# Altium schematic sheet main.SchDoc
size 420 x 297 mm; SheetNumber: 1; SheetTotal: 1
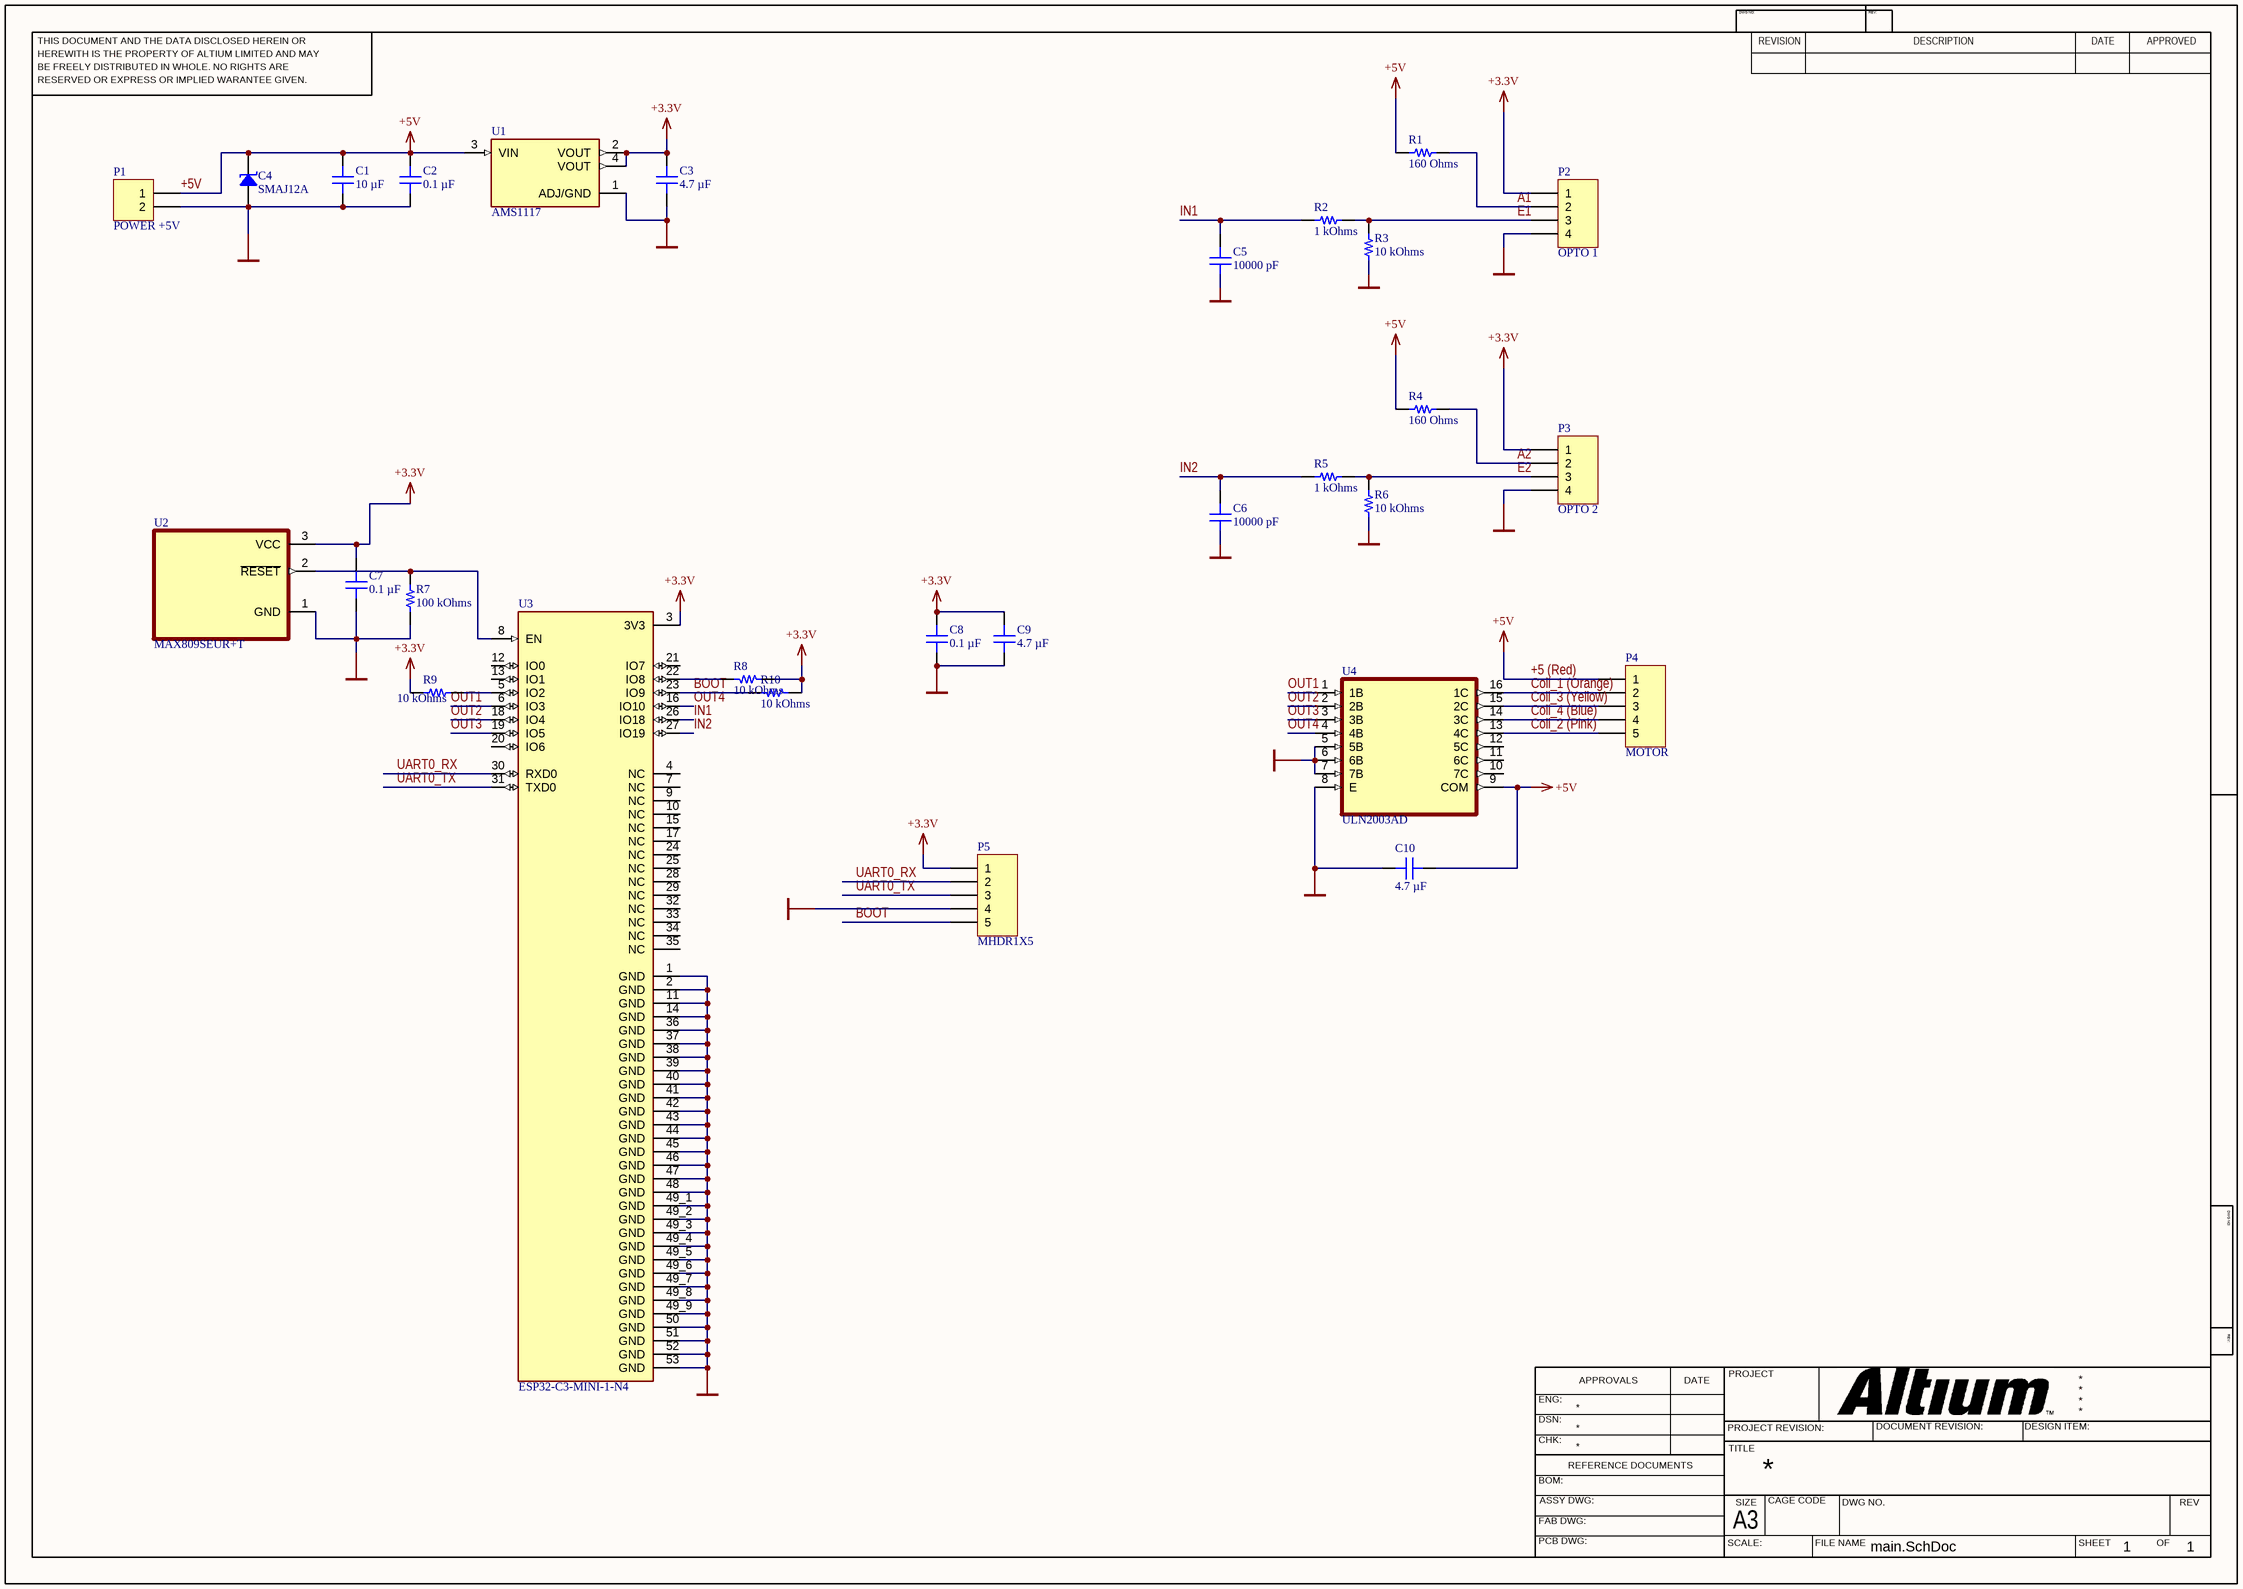
[diagram p0: main.SchDoc]

## Parts
C1  10 µF  [CAP 0805_2012]
C2  0.1 µF  [CAP 0603_1608]
C3  Capacitance: 4.7 µF  [CAP 0603_1608]
C4  SMAJ12A  [DO214AC SMA]
C5  10000 pF  [CAP 0603_1608]
C6  10000 pF  [CAP 0603_1608]
C7  0.1 µF  [CAP 0603_1608]
C8  0.1 µF  [CAP 0603_1608]
C9  4.7 µF  [CAP 0603_1608]
C10  Capacitance: 4.7 µF  [CAP 0603_1608]
P1  POWER +5V  [HDR1X2H]
P2  OPTO 1  [HDR1X4H]
P3  OPTO 2  [HDR1X4H]
P4  MOTOR  [HDR1X5H]
P5  MHDR1X5  [MHDR1X5]
R1  160 Ohms  [YAGEO RES 0805_2012]
R2  1 kOhms  [YAGEO RES 0603_1608]
R3  10 kOhms  [YAGEO RES 0603_1608]
R4  160 Ohms  [YAGEO RES 0805_2012]
R5  1 kOhms  [YAGEO RES 0603_1608]
R6  10 kOhms  [YAGEO RES 0603_1608]
R7  100 kOhms  [YAGEO RES 0603_1608]
R8  10 kOhms  [YAGEO RES 0603_1608]
R9  10 kOhms  [YAGEO RES 0603_1608]
R10  10 kOhms  [YAGEO RES 0603_1608]
U1  AMS1117  [SOT229P700X180-4N]
U2  MAX809SEUR+T  [SOT95P237X112-3N]
U3  ESP32-C3-MINI-1-N4  [XCVR_ESP32-C3-MINI-1-N4]
U4  ULN2003AD  [SOIC127P600X175-16N]

## Nets
+3.3V: C3.2 C7.2 C8.2 C9.2 P2.1 P3.1 P5.1 R8.2 R9.2 R10.2 U1.2(VOUT) U1.4(VOUT) U2.3(VCC) U3.3(3V3)
+5 (Red): C1.2 C2.2 C4.2 C10.1 P1.1 P4.1 R1.2 R4.2 U1.3(VIN) U4.9(COM)  [also labelled +5V]
GND: C1.1 C2.1 C3.1 C4.1 C5.1 C6.1 C7.1 C8.1 C9.1 C10.2 P1.2 P2.4 P3.4 P5.4 R3.1 R6.1 R7.1 U1.1(ADJ/GND) U2.1(GND) U3.1(GND) U3.2(GND) U3.11(GND) U3.14(GND) U3.36(GND) U3.37(GND) U3.38(GND) U3.39(GND) U3.40(GND) U3.41(GND) U3.42(GND) U3.43(GND) U3.44(GND) U3.45(GND) U3.46(GND) U3.47(GND) U3.48(GND) U3.49_1(GND) U3.49_2(GND) U3.49_3(GND) U3.49_4(GND) U3.49_5(GND) U3.49_6(GND) U3.49_7(GND) U3.49_8(GND) U3.49_9(GND) U3.50(GND) U3.51(GND) U3.52(GND) U3.53(GND) U4.5(5B) U4.6(6B) U4.7(7B) U4.8(E)
A1: P2.2 R1.1
A2: P3.2 R4.1
BOOT: P5.5 R10.1 U3.23(IO9)
Coil_1 (Orange): P4.2 U4.16(1C)
Coil_2 (Pink): P4.5 U4.13(4C)
Coil_3 (Yellow): P4.3 U4.15(2C)
Coil_4 (Blue): P4.4 U4.14(3C)
E1: P2.3 R2.1 R3.2
E2: P3.3 R5.1 R6.2
IN1: C5.2 R2.2 U3.26(IO18)
IN2: C6.2 R5.2 U3.27(IO19)
OUT1: U3.6(IO3) U4.1(1B)
OUT2: U3.18(IO4) U4.2(2B)
OUT3: U3.19(IO5) U4.3(3B)
OUT4: U3.16(IO10) U4.4(4B)
UART0_RX: P5.2 U3.30(RXD0)
UART0_TX: P5.3 U3.31(TXD0)
NetR7_2: R7.2 U2.2(~{RESET}) U3.8(EN)
NetR8_1: R8.1 U3.22(IO8)
NetR9_1: R9.1 U3.5(IO2)

Not connected (* = marked no-connect by the designer): U3 4(NC) 7(NC) 9(NC) 10(NC) 12(IO0) 13(IO1) 15(NC) 17(NC) 20(IO6) 21(IO7) 24(NC) 25(NC) 28(NC) 29(NC) 32(NC) 33(NC) 34(NC) 35(NC); U4 10(7C) 11(6C) 12(5C)

## Notes on the sheet
- THIS DOCUMENT AND THE DATA DISCLOSED HEREIN OR
- HEREWITH IS THE PROPERTY OF ALTIUM LIMITED AND MAY
- DWG NO:
- REVISION
- REV:
- DESCRIPTION
- DATE
- APPROVED
- BE FREELY DISTRIBUTED IN WHOLE. NO RIGHTS ARE
- RESERVED OR EXPRESS OR IMPLIED WARANTEE GIVEN.
- ENG:
- APPROVALS
- PROJECT
- DSN:
- CHK:
- REFERENCE DOCUMENTS
- PROJECT REVISION:
- TITLE
- DOCUMENT REVISION:
- DESIGN ITEM:
- BOM:
- FAB DWG:
- PCB DWG:
- ASSY DWG:
- SCALE:
- A3
- SIZE
- CAGE CODE
- FILE NAME
- DWG NO.
- SHEET
- OF
- REV

## Library data of the parts
C1 = CC0805KKX5R8BB106: CAP CER 10UF 25V X5R 0805; manufacturer: Yageo; Tolerance: ±10%; Part Number: CC0805KKX5R8BB106; Capacitance: 10 µF; Applications: General Purpose; componentlink1description: Datasheet; componentlink1url: https://www.yageo.com/upload/media/product/productsearch/datasheet/mlcc/UPY-GPHC_X5R_4V-to-50V_25.pdf; componentlink2description: DigiKey Link; componentlink2url: https://www.digikey.com/en/products/detail/yageo/CC0805KKX5R8BB106/5195275; Device Package: 0805 (2012 Metric); lastupdated: 09.02.2024 20:15:28; Lifecycle Status: Active; Minimum Order: 1; Mounting Type: Surface Mount, MLCC; Operating Temperature: -55°C ~ 85°C; Package / Case: 0805 (2012 Metric); packaging: TapeAndReel; partid: 16151; Part Status: Active; price: 0.06; series: CC; Size / Dimension: 0.079" L x 0.049" W (2.00mm x 1.25mm); Supplier 1: DigiKey; Supplier Part Number 1: 311-1869-1-ND; Temperature Coefficient: X5R; Thickness (Max): 0.057" (1.45mm); value: 10 µF; Voltage - Rated: 25V
C2 C7 C8 = CC0603KRX7R9BB104: CAP CER 0.1UF 50V X7R 0603; manufacturer: Yageo; Tolerance: ±10%; Part Number: CC0603KRX7R9BB104; Capacitance: 0.1 µF; Applications: General Purpose; componentlink1description: Datasheet; componentlink1url: https://www.yageo.com/upload/media/product/productsearch/datasheet/mlcc/UPY-GPHC_X7R_6.3V-to-50V_18.pdf; componentlink2description: DigiKey Link; componentlink2url: https://www.digikey.com/en/products/detail/yageo/CC0603KRX7R9BB104/2103082; Device Package: 0603 (1608 Metric); lastupdated: 09.02.2024 20:10:21; Lifecycle Status: Active; Minimum Order: 1; Mounting Type: Surface Mount, MLCC; Operating Temperature: -55°C ~ 125°C; Package / Case: 0603 (1608 Metric); packaging: TapeAndReel; partid: 9506; Part Status: Active; price: 0.01; series: CC; Size / Dimension: 0.063" L x 0.031" W (1.60mm x 0.80mm); Supplier 1: DigiKey; Supplier Part Number 1: 311-1344-1-ND; Temperature Coefficient: X7R; Thickness (Max): 0.035" (0.90mm); value: 0.1 µF; Voltage - Rated: 50V
C3 C10 = C0603C475K9PAC7867: CAP CER 4.7UF 6.3V X5R 0603; Part Number: C0603C475K9PAC7867
C4 = SMAJ12A: TVS DIODE 12VWM 19.9VC DO214AC; Manufacturer: Littelfuse Inc.; Current - Peak Pulse (10/1000µs): 20.1A; Power Line Protection: No; Power - Peak Pulse: 400W; Type: Zener; Unidirectional Channels: 1; Voltage - Breakdown (Min): 13.3V; Voltage - Clamping (Max) @ Ipp: 19.9V; Voltage - Reverse Standoff (Typ): 12V; Part Number: SMAJ12A; Applications: General Purpose; ComponentLink1Description: Datasheet; ComponentLink1URL: https://www.littelfuse.com/~/media/electronics/datasheets/tvs_diodes/littelfuse_tvs_diode_smaj_datasheet.pdf.pdf; ComponentLink2Description: DigiKey Link; ComponentLink2URL: https://www.digikey.com/en/products/detail/littelfuse-inc/SMAJ12A/762270; LastUpdated: 03.06.2024 19:57:22; Lifecycle Status: Active; Minimum Order: 1; Mounting Type: Surface Mount; Operating Temperature: -65°C ~ 150°C (TJ); Package / Case: DO-214AC, SMA; Packaging: TapeAndReel; PartId: 5712; Part Status: Active; Price: 0.08; Series: SMAJ; Supplier 1: DigiKey; Supplier Part Number 1: SMAJ12ALFCT-ND; Supplier Device Package: DO-214AC (SMA)
C5 C6 = CC0603KRX7R9BB103: CAP CER 10000PF 50V X7R 0603; manufacturer: Yageo; Tolerance: ±10%; Part Number: CC0603KRX7R9BB103; Capacitance: 10000 pF; Applications: General Purpose; componentlink1description: Datasheet; componentlink1url: https://www.yageo.com/upload/media/product/productsearch/datasheet/mlcc/UPY-GPHC_X7R_6.3V-to-50V_18.pdf; componentlink2description: DigiKey Link; componentlink2url: https://www.digikey.com/en/products/detail/yageo/CC0603KRX7R9BB103/302819; Device Package: 0603 (1608 Metric); lastupdated: 09.02.2024 20:10:06; Lifecycle Status: Active; Minimum Order: 1; Mounting Type: Surface Mount, MLCC; Operating Temperature: -55°C ~ 125°C; Package / Case: 0603 (1608 Metric); packaging: TapeAndReel; partid: 17848; Part Status: Active; price: 0.01; series: CC; Size / Dimension: 0.063" L x 0.031" W (1.60mm x 0.80mm); Supplier 1: DigiKey; Supplier Part Number 1: 311-1085-1-ND; Temperature Coefficient: X7R; Thickness (Max): 0.035" (0.90mm); value: 10000 pF; Voltage - Rated: 50V
C9 = C0603C475K9PAC7867: CAP CER 4.7UF 6.3V X5R 0603; manufacturer: KEMET; Tolerance: ±10%; Part Number: C0603C475K9PAC7867; Capacitance: 4.7 µF; Applications: Bypass, Decoupling; componentlink1description: Datasheet; componentlink1url: https://api.kemet.com/component-edge/download/datasheet/C0603C475K9PACTU.pdf; componentlink2description: DigiKey Link; componentlink2url: https://www.digikey.com/en/products/detail/kemet/C0603C475K9PAC7867/754744; Device Package: 0603 (1608 Metric); lastupdated: 09.02.2024 20:09:55; Lifecycle Status: Active; Minimum Order: 1; Mounting Type: Surface Mount, MLCC; Operating Temperature: -55°C ~ 85°C; Package / Case: 0603 (1608 Metric); packaging: TapeAndReel; partid: 34879; Part Status: Active; price: 0.02; series: SMD Comm X5R; Size / Dimension: 0.063" L x 0.031" W (1.60mm x 0.80mm); Supplier 1: DigiKey; Supplier Part Number 1: 399-C0603C475K9PAC7867CT-ND; Temperature Coefficient: X5R; Thickness (Max): 0.035" (0.90mm); value: 4.7 µF; Voltage - Rated: 6.3V
P1 = Header 2H: Header, 2-Pin, Right Angle; LatestRevisionDate: 17-Jul-2002; LatestRevisionNote: Re-released for DXP Platform.; Publisher: Altium Limited
P2 P3 = Header 4H: Header, 4-Pin, Right Angle; LatestRevisionDate: 17-Jul-2002; LatestRevisionNote: Re-released for DXP Platform.; Publisher: Altium Limited
P4 = Header 5H: Header, 5-Pin, Right Angle; LatestRevisionDate: 17-Jul-2002; LatestRevisionNote: Re-released for DXP Platform.; Publisher: Altium Limited
P5 = MHDR1X5: Header, 5-Pin; LatestRevisionDate: 17-Jul-2002; LatestRevisionNote: Re-released for DXP Platform.; Publisher: Altium Limited
R1 R4 = RC0805JR-07160RL: RES 160 OHM 5% 1/8W 0805; Manufacturer: Yageo; Power (Watts): 0.125W, 1/8W; Temperature Coefficient: ±100ppm/°C; Part Number: RC0805JR-07160RL; Value: 160 Ohms; ComponentLink1Description: Datasheet; ComponentLink1URL: https://www.yageo.com/upload/media/product/productsearch/datasheet/rchip/PYu-RC_Group_51_RoHS_L_10.pdf; ComponentLink2Description: DigiKey Link; ComponentLink2URL: https://www.digikey.com/en/products/detail/yageo/RC0805JR-07160RL/728259; Composition: Thick Film; Device Package: 0805 (2012 Metric); Features: Moisture Resistant; Height - Seated (Max): 0.024" (0.60mm); LastUpdated: 25.07.2024 9:20:20; Lifecycle Status: Active; Minimum Order: 1; Number of Terminations: 2; Operating Temperature: -55°C ~ 155°C; Package / Case: 0805 (2012 Metric); Packaging: CutTape; PartId: 41917; Part Status: Active; Price: 0.01; Resistance: 160 Ohms; Series: RC_L; Size / Dimension: 0.079" L x 0.049" W (2.00mm x 1.25mm); Supplier 1: DigiKey; Supplier Part Number 1: 311-160ARCT-ND; Supplier Device Package: 0805; Tolerance: ±5%
R2 R5 = RC0603JR-071KL: RES 1K OHM 5% 1/10W 0603; Manufacturer: Yageo; Power (Watts): 0.1W, 1/10W; Temperature Coefficient: ±100ppm/°C; Part Number: RC0603JR-071KL; Value: 1 kOhms; ComponentLink1Description: Datasheet; ComponentLink1URL: https://www.yageo.com/upload/media/product/productsearch/datasheet/rchip/PYu-RC_Group_51_RoHS_L_10.pdf; ComponentLink2Description: DigiKey Link; ComponentLink2URL: https://www.digikey.com/en/products/detail/yageo/RC0603JR-071KL/726677; Composition: Thick Film; Device Package: 0603 (1608 Metric); Features: Moisture Resistant; Height - Seated (Max): 0.022" (0.55mm); LastUpdated: 25.07.2024 9:19:19; Lifecycle Status: Active; Minimum Order: 1; Number of Terminations: 2; Operating Temperature: -55°C ~ 155°C; Package / Case: 0603 (1608 Metric); Packaging: CutTape; PartId: 22594; Part Status: Active; Price: 0.01; Resistance: 1 kOhms; Series: RC_L; Size / Dimension: 0.063" L x 0.031" W (1.60mm x 0.80mm); Supplier 1: DigiKey; Supplier Part Number 1: 311-1.0KGRCT-ND; Supplier Device Package: 0603; Tolerance: ±5%
R3 R6 R8-R10 = RC0603JR-0710KL: RES 10K OHM 5% 1/10W 0603; Manufacturer: Yageo; Power (Watts): 0.1W, 1/10W; Temperature Coefficient: ±100ppm/°C; Part Number: RC0603JR-0710KL; Value: 10 kOhms; ComponentLink1Description: Datasheet; ComponentLink1URL: https://www.yageo.com/upload/media/product/productsearch/datasheet/rchip/PYu-RC_Group_51_RoHS_L_10.pdf; ComponentLink2Description: DigiKey Link; ComponentLink2URL: https://www.digikey.com/en/products/detail/yageo/RC0603JR-0710KL/726700; Composition: Thick Film; Device Package: 0603 (1608 Metric); Features: Moisture Resistant; Height - Seated (Max): 0.022" (0.55mm); LastUpdated: 25.07.2024 9:19:19; Lifecycle Status: Active; Minimum Order: 1; Number of Terminations: 2; Operating Temperature: -55°C ~ 155°C; Package / Case: 0603 (1608 Metric); Packaging: CutTape; PartId: 22593; Part Status: Active; Price: 0.01; Resistance: 10 kOhms; Series: RC_L; Size / Dimension: 0.063" L x 0.031" W (1.60mm x 0.80mm); Supplier 1: DigiKey; Supplier Part Number 1: 311-10KGRCT-ND; Supplier Device Package: 0603; Tolerance: ±5%
R7 = RC0603JR-07100KL: RES 100K OHM 5% 1/10W 0603; Manufacturer: Yageo; Power (Watts): 0.1W, 1/10W; Temperature Coefficient: ±100ppm/°C; Part Number: RC0603JR-07100KL; Value: 100 kOhms; ComponentLink1Description: Datasheet; ComponentLink1URL: https://www.yageo.com/upload/media/product/productsearch/datasheet/rchip/PYu-RC_Group_51_RoHS_L_10.pdf; ComponentLink2Description: DigiKey Link; ComponentLink2URL: https://www.digikey.com/en/products/detail/yageo/RC0603JR-07100KL/726698; Composition: Thick Film; Device Package: 0603 (1608 Metric); Features: Moisture Resistant; Height - Seated (Max): 0.022" (0.55mm); LastUpdated: 25.07.2024 9:19:16; Lifecycle Status: Active; Minimum Order: 1; Number of Terminations: 2; Operating Temperature: -55°C ~ 155°C; Package / Case: 0603 (1608 Metric); Packaging: CutTape; PartId: 25667; Part Status: Active; Price: 0.01; Resistance: 100 kOhms; Series: RC_L; Size / Dimension: 0.063" L x 0.031" W (1.60mm x 0.80mm); Supplier 1: DigiKey; Supplier Part Number 1: 311-100KGRCT-ND; Supplier Device Package: 0603; Tolerance: ±5%
U1 = AMS1117: 1A LOW DROPOUT VOLTAGE REGULATOR SOT-223; MF: Advanced Monolithic Systems; Price: None; Availability: Not in stock; Package: SOT-223 Seeed Technology; MP: AMS1117; Value: *; SnapEDA_Link: https://www.snapeda.com/parts/AMS1117/Advanced+Monolithic+Systems/view-part/?ref=snap; Check_prices: https://www.snapeda.com/parts/AMS1117/Advanced+Monolithic+Systems/view-part/?ref=eda
U3 = ESP32-C3-MINI-1-N4: Bluetooth, WiFi 802.11b/g/n, Bluetooth v5.0 Transceiver Module 2.412GHz ~ 2.484GHz PCB Trace Surface Mount; MF: Espressif Systems; SnapEDA_Link: https://www.snapeda.com/parts/ESP32-C3-MINI-1-N4/Espressif+Systems/view-part/?ref=snap; Package: SMD-53 Espressif Systems; Value: *; MP: ESP32-C3-MINI-1-N4; Check_prices: https://www.snapeda.com/parts/ESP32-C3-MINI-1-N4/Espressif+Systems/view-part/?ref=eda
U4 = ULN2003AD: 50-V, 7-ch darlington transistor array, -20C to 70C; MF: Texas Instruments; Check_prices: https://www.snapeda.com/parts/ULN2003AD/Texas+Instruments/view-part/?ref=eda; SnapEDA_Link: https://www.snapeda.com/parts/ULN2003AD/Texas+Instruments/view-part/?ref=snap; Price: None; Availability: In Stock; Value: *; MP: ULN2003AD; Package: SOIC-16 Texas Instruments; Purchase-URL: https://pricing.snapeda.com/search/part/ULN2003AD/?ref=eda
U2 = MAX809SEUR+T: Package: None; Price: None; Value: *; MP: MAX809SEUR+T; Availability: Unavailable